# EAGLE design b1 (EAGLE 6.4)
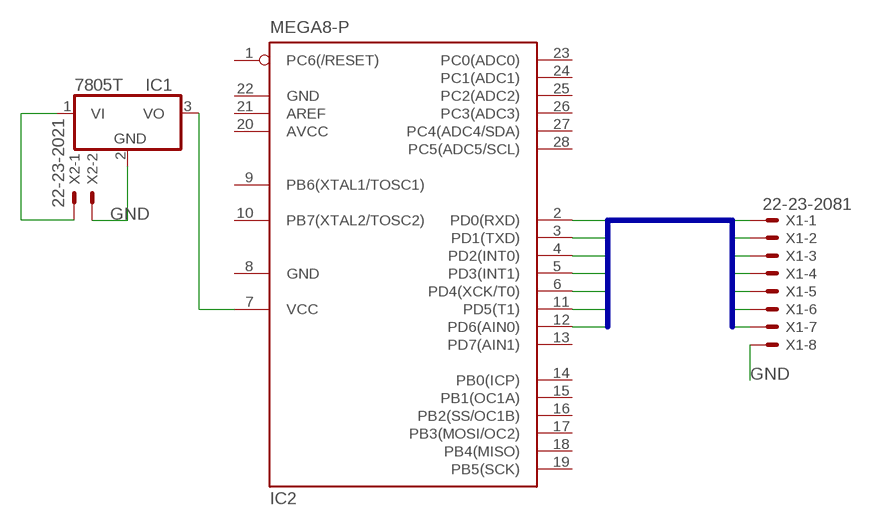
[diagram p0: schematic, sheet 1]

## Parts
IC1  7805T  [TO220H]
IC2  MEGA8-P  [DIL28-3]
X1  22-23-2081  [22-23-2081]
X2  22-23-2021  [22-23-2021]

## Nets
GND: IC1.2(GND) X1.8 X2.2
N$9: IC1.1(VI) X2.1
N$10 [GND]: IC1.3(VO) IC2.7(VCC)
P1: IC2.2(PD0(RXD)) X1.1
P2: IC2.3(PD1(TXD)) X1.2
P3: IC2.4(PD2(INT0)) X1.3
P4: IC2.5(PD3(INT1)) X1.4
P5: IC2.6(PD4(XCK/T0)) X1.5
P6: IC2.11(PD5(T1)) X1.6
P7: IC2.12(PD6(AIN0)) X1.7
Unconnected: IC2.1(PC6(/RESET)) IC2.9(PB6(XTAL1/TOSC1)) IC2.10(PB7(XTAL2/TOSC2)) IC2.13(PD7(AIN1)) IC2.14(PB0(ICP)) IC2.15(PB1(OC1A)) IC2.16(PB2(SS/OC1B)) IC2.17(PB3(MOSI/OC2)) IC2.18(PB4(MISO)) IC2.19(PB5(SCK)) IC2.21(AREF) IC2.23(PC0(ADC0)) IC2.24(PC1(ADC1)) IC2.25(PC2(ADC2)) IC2.26(PC3(ADC3)) IC2.27(PC4(ADC4/SDA)) IC2.28(PC5(ADC5/SCL))

## Buses
P[1..7]

## Power pins joined to a net without a drawn wire
AVCC: IC2.20(AVCC)
GND: IC2.8(GND) IC2.22(GND)

## Library data of the parts
IC1 = linear:78*: Positive VOLTAGE REGULATOR Source: http://cache.national.com/ds/LM/LM78L05.pdf http://www.fairchildsemi.com/ds/LM/LM7805.pdf
IC2 = atmel:MEGA8-P: MICROCONTROLLER 8 Kbytes FLASH, 1 kbytes SRAM, 512 bytes EEPROM, USART, 4-channel 10 bit ADC, 2-channel 8 bit ADC Pin compatible with Atmega48, ATMega88, ATMega168 Source: avr.lbr; OC_FARNELL: unknown; OC_NEWARK: unknown
X1 = con-molex:22-23-2081: .100" (2.54mm) Center Header - 8 Pin; MF: MOLEX; MPN: 22-23-2081; OC_FARNELL: 1756826; OC_NEWARK: 01C7592
X2 = con-molex:22-23-2021: .100" (2.54mm) Center Header - 2 Pin; MF: MOLEX; MPN: 22-23-2021; OC_FARNELL: 1462926; OC_NEWARK: 25C3832

## Net classes
1 GND: width 0.61 mm, drill 0.61 mm, clearance 0.61 mm

## Board
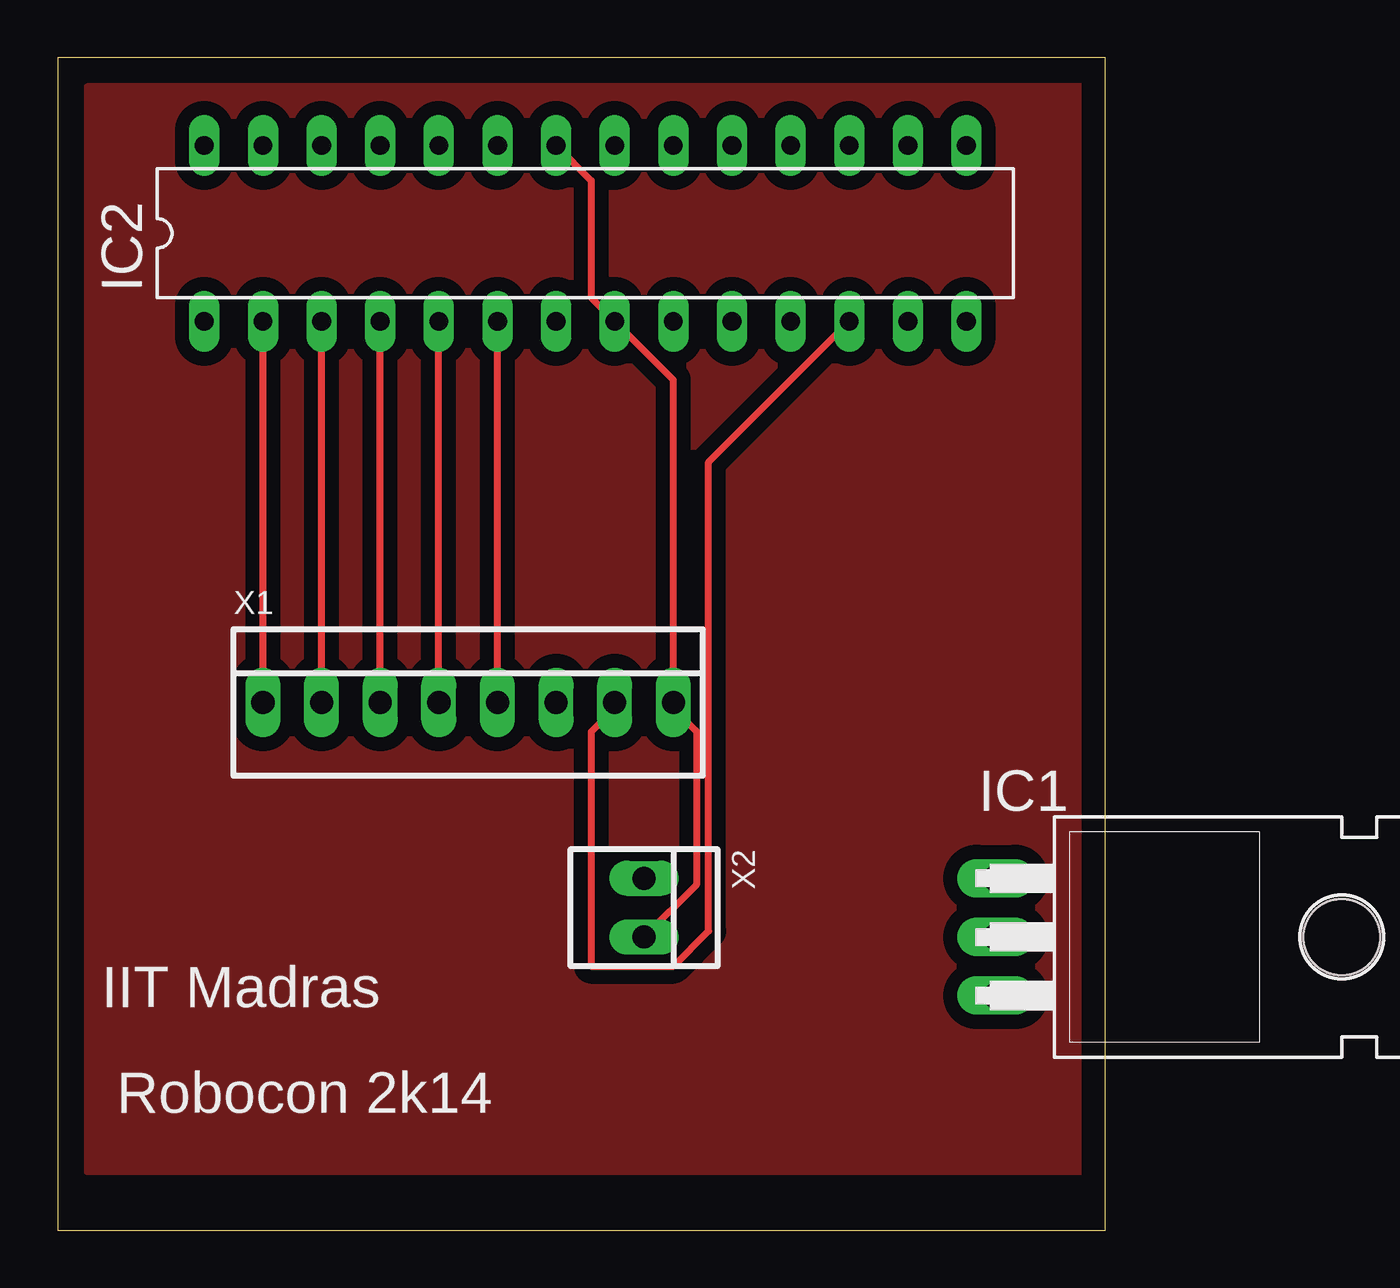
[diagram p1: board, top side]
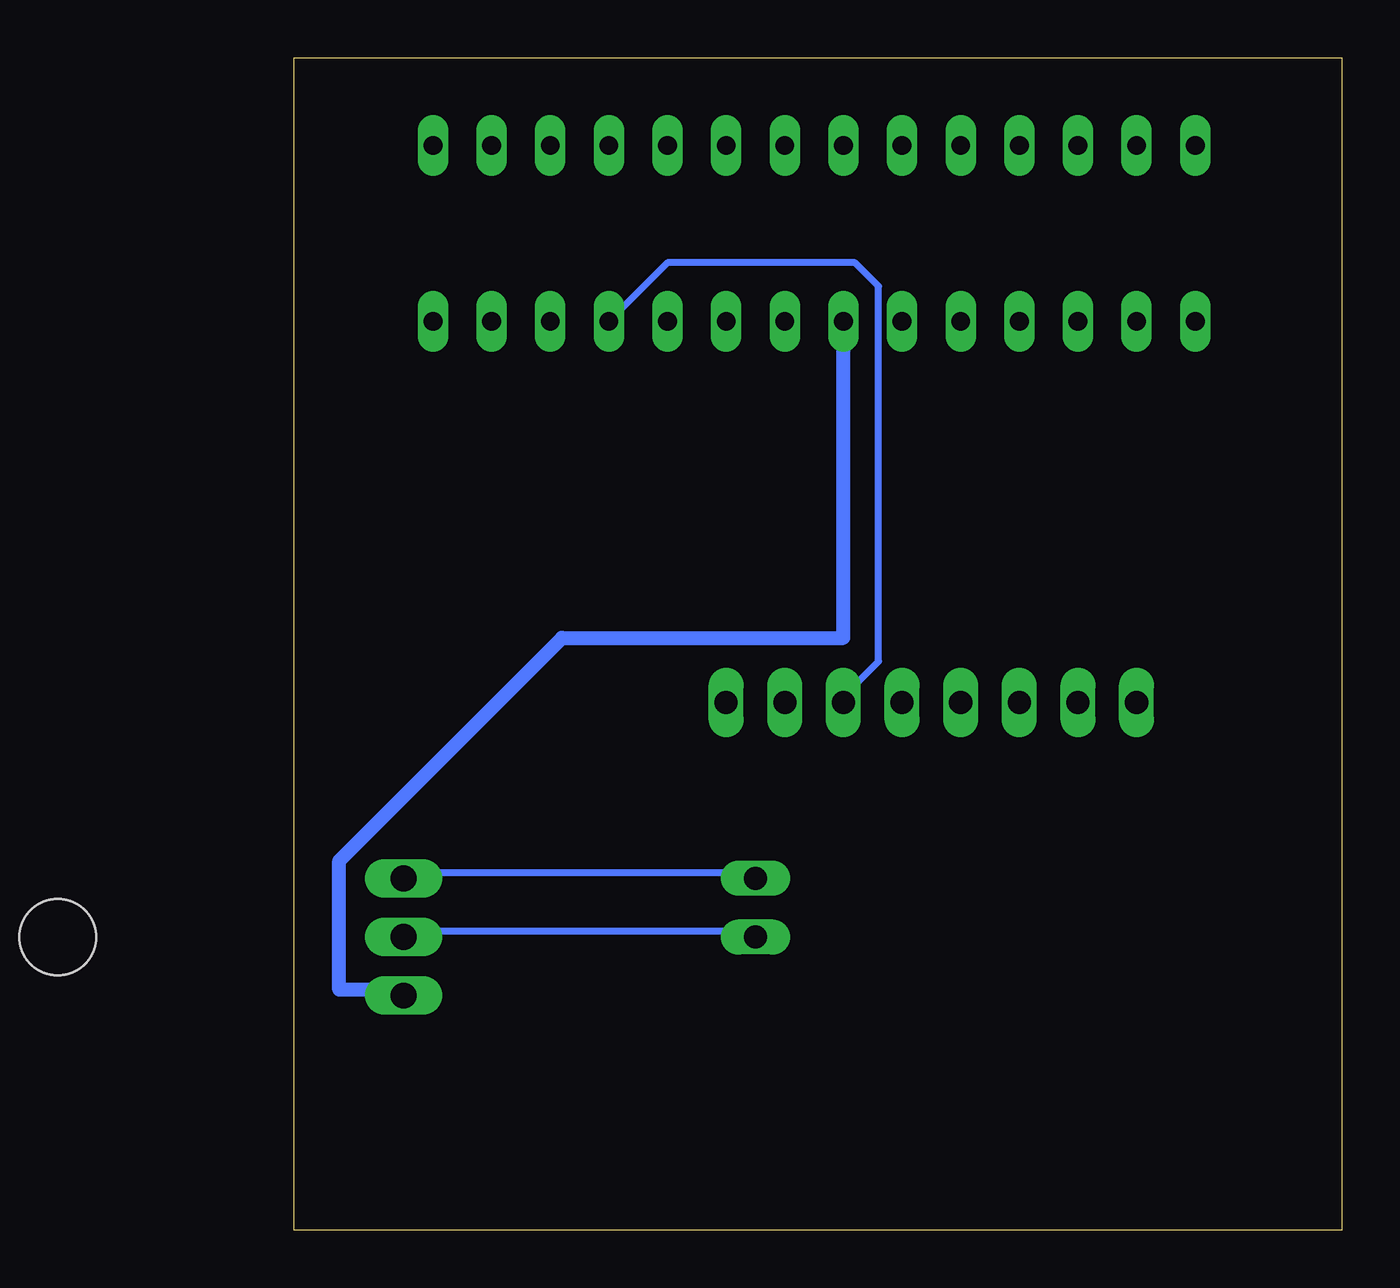
[diagram p2: board, bottom side, seen from below]

Size 45.39 x 50.79 mm. Coordinates in mm from the lower left corner, seen from the top.
Outline: 0,0 45.39,0 45.39,50.79 0,50.79 0,0
Copper layers (1*16): Top 0.035mm / dielectric 1.5mm / Bottom 0.035mm
Design rules "default *": minimum track width 12mil, minimum drill 24mil, track to track 8mil, track to pad 8mil, pad to pad 8mil, via to via 8mil, smd to smd 8mil, copper to edge 40mil, drill to drill 8mil, minimum pad ring 10mil, minimum via ring 8mil, stop-mask expansion 4mil, vias tented up to drill 0mil, thermal gap 10mil

### Footprints (pad centres in the part's own frame; a part is rotated, then mirrored left to right if it is on the bottom)
TO220H = drill 1.118 long: 1 -2.54,-10.16; 2 0,-10.16; 3 2.54,-10.16 | hole 3.302: 0,4.826
DIL28-3 = drill 0.813 long: 1 -16.51,-3.81; 2 -13.97,-3.81; 3 -11.43,-3.81; 4 -8.89,-3.81; 5 -6.35,-3.81; 6 -3.81,-3.81; 7 -1.27,-3.81; 8 1.27,-3.81; 9 3.81,-3.81; 10 6.35,-3.81; 11 8.89,-3.81; 12 11.43,-3.81; 13 13.97,-3.81; 14 16.51,-3.81; 15 16.51,3.81; 16 13.97,3.81; 17 11.43,3.81; 18 8.89,3.81; 19 6.35,3.81; 20 3.81,3.81; 21 1.27,3.81; 22 -1.27,3.81; 23 -3.81,3.81; 24 -6.35,3.81; 25 -8.89,3.81; 26 -11.43,3.81; 27 -13.97,3.81; 28 -16.51,3.81
22-23-2081 = drill 1 long: 1 -8.89,0; 2 -6.35,0; 3 -3.81,0; 4 -1.27,0; 5 1.27,0; 6 3.81,0; 7 6.35,0; 8 8.89,0
22-23-2021 = drill 1 long: 1 -1.27,0; 2 1.27,0

### Placement (x,y rotation side)
IC1  50.8,12.7 270 top
IC2  22.86,43.18 0 top
X1  17.78,22.86 0 top
X2  25.4,13.97 270 top

### Tracks (layer width: path | path; a pad name or v marks a point on that pad's centre or on a via)
GND
  Top 0.305: IC2.22 23.11,45.47 23.11,40.39 IC2.8 26.67,36.83 X1.8 26.67,22.61 27.69,21.59 27.69,14.99 X2.2
  Bottom 0.305: X2.2 25.65,12.95 40.39,12.95 IC1.2
N$1
  pour Top (isolate 0.61): 44.45,49.53 1.27,49.53 1.27,2.54 44.45,2.54
N$9
  Bottom 0.305: X2.1 25.65,15.49 40.39,15.49 IC1.1
N$10
  Bottom 0.61: IC2.7 21.59,25.65 33.78,25.65 43.43,16 43.43,10.41 40.89,10.41 IC1.3
P1
  Top 0.305: X1.1 IC2.2
P2
  Top 0.305: X1.2 IC2.3
P3
  Top 0.305: X1.3 IC2.4
P4
  Top 0.305: X1.4 IC2.5
P5
  Top 0.305: X1.5 IC2.6
P6
  Bottom 0.305: IC2.11 29.21,41.91 21.08,41.91 20.07,40.89 20.07,24.64 21.59,23.11 X1.6
P7
  Top 0.305: IC2.12 28.19,33.27 28.19,12.95 26.67,11.43 23.11,11.43 23.11,21.59 24.13,22.61 X1.7

### Text on the board
tPlace: IIT Madras | Robocon 2k14